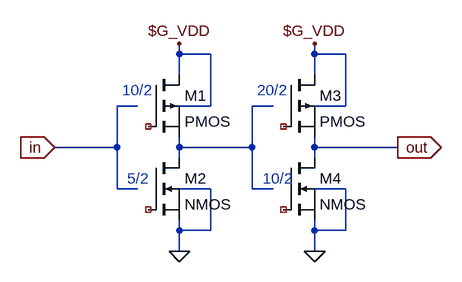
[diagram p0: schematic buf.asc]
buf.asc, the LTspice schematic file:
Version 4
SHEET 1 1292 836
WIRE -624 -80 -624 -96
WIRE -576 -80 -624 -80
WIRE -416 -80 -416 -96
WIRE -368 -80 -416 -80
WIRE -624 -48 -624 -80
WIRE -416 -48 -416 -80
WIRE -688 0 -720 0
WIRE -576 0 -576 -80
WIRE -576 0 -624 0
WIRE -480 0 -512 0
WIRE -368 0 -368 -80
WIRE -368 0 -416 0
WIRE -720 64 -720 0
WIRE -720 64 -816 64
WIRE -624 64 -624 48
WIRE -512 64 -512 0
WIRE -512 64 -624 64
WIRE -416 64 -416 48
WIRE -288 64 -416 64
WIRE -624 80 -624 64
WIRE -416 80 -416 64
WIRE -720 128 -720 64
WIRE -688 128 -720 128
WIRE -576 128 -624 128
WIRE -512 128 -512 64
WIRE -480 128 -512 128
WIRE -368 128 -416 128
WIRE -624 192 -624 176
WIRE -576 192 -576 128
WIRE -576 192 -624 192
WIRE -416 192 -416 176
WIRE -368 192 -368 128
WIRE -368 192 -416 192
WIRE -624 224 -624 192
WIRE -416 224 -416 192
FLAG -624 224 0
FLAG -816 64 in
IOPIN -816 64 In
FLAG -288 64 out
IOPIN -288 64 Out
FLAG -624 -96 $G_VDD
FLAG -416 224 0
FLAG -416 -96 $G_VDD
SYMBOL pmos -672 -48 R0
SYMATTR InstName M1
SYMATTR Value2 l=0.6u w=3u
SYMATTR SpiceModel ""
SYMATTR Value PMOS
SYMBOL nmos -672 80 R0
SYMATTR InstName M2
SYMATTR Value2 l=0.6u w=1.5u
SYMATTR SpiceModel ""
SYMATTR Value NMOS
SYMBOL pmos -464 -48 R0
SYMATTR InstName M3
SYMATTR Value2 l=0.6u w=6u
SYMATTR SpiceModel ""
SYMATTR Value PMOS
SYMBOL nmos -464 80 R0
SYMATTR InstName M4
SYMATTR Value2 l=0.6u w=3u
SYMATTR SpiceModel ""
SYMATTR Value NMOS
TEXT -712 -24 Left 2 ;10/2
TEXT -704 112 Left 2 ;5/2
TEXT -504 -24 Left 2 ;20/2
TEXT -496 112 Left 2 ;10/2

The netlist it stands for:
* buf.asc
* M1: PMOS l=0.6u w=3u (symbol pmos not certain, pin order unknown); nets seen at it: $G_VDD, N001
* M2: NMOS l=0.6u w=1.5u (symbol nmos not certain, pin order unknown); nets seen at it: 0, N001
* M3: PMOS l=0.6u w=6u (symbol pmos not certain, pin order unknown); nets seen at it: $G_VDD, out
* M4: NMOS l=0.6u w=3u (symbol nmos not certain, pin order unknown); nets seen at it: 0, out
* 10/2
* 5/2
* 20/2
* 10/2
.backanno
.end